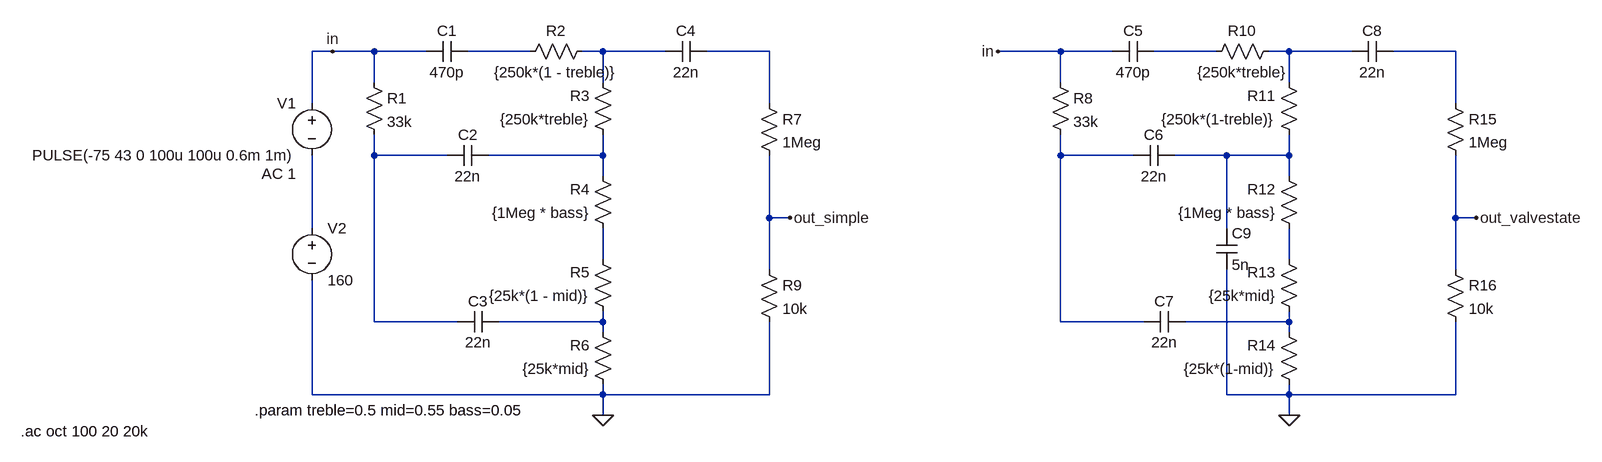
[diagram p0: schematic fmv.asc]
fmv.asc, the LTspice schematic file:
Version 4
SHEET 1 1936 776
WIRE -16 0 -48 0
WIRE 48 0 -16 0
WIRE 128 0 48 0
WIRE 288 0 192 0
WIRE 400 0 368 0
WIRE 496 0 400 0
WIRE 656 0 560 0
WIRE 1104 0 1008 0
WIRE 1184 0 1104 0
WIRE 1344 0 1248 0
WIRE 1456 0 1424 0
WIRE 1552 0 1456 0
WIRE 1712 0 1616 0
WIRE 48 48 48 0
WIRE 400 48 400 0
WIRE 1104 48 1104 0
WIRE 1456 48 1456 0
WIRE -48 80 -48 0
WIRE 656 80 656 0
WIRE 1712 80 1712 0
WIRE 48 160 48 128
WIRE 160 160 48 160
WIRE 400 160 400 128
WIRE 400 160 224 160
WIRE 1104 160 1104 128
WIRE 1216 160 1104 160
WIRE 1360 160 1280 160
WIRE 1456 160 1456 128
WIRE 1456 160 1360 160
WIRE 400 192 400 160
WIRE 1456 192 1456 160
WIRE 656 256 656 160
WIRE 688 256 656 256
WIRE 1712 256 1712 160
WIRE 1744 256 1712 256
WIRE -48 272 -48 160
WIRE 1360 272 1360 160
WIRE 400 320 400 272
WIRE 1456 320 1456 272
WIRE 656 336 656 256
WIRE 1712 336 1712 256
WIRE 48 416 48 160
WIRE 176 416 48 416
WIRE 400 416 400 400
WIRE 400 416 240 416
WIRE 1104 416 1104 160
WIRE 1232 416 1104 416
WIRE 1456 416 1456 400
WIRE 1456 416 1296 416
WIRE 400 432 400 416
WIRE 1456 432 1456 416
WIRE -48 528 -48 352
WIRE 400 528 400 512
WIRE 400 528 -48 528
WIRE 656 528 656 416
WIRE 656 528 400 528
WIRE 1360 528 1360 336
WIRE 1456 528 1456 512
WIRE 1456 528 1360 528
WIRE 1712 528 1712 416
WIRE 1712 528 1456 528
WIRE 400 560 400 528
WIRE 1456 560 1456 528
FLAG 400 560 0
FLAG 688 256 out_simple
FLAG 1456 560 0
FLAG 1744 256 out_valvestate
FLAG -16 0 in
FLAG 1008 0 in
SYMBOL res 32 32 R0
SYMATTR InstName R1
SYMATTR Value 33k
SYMBOL res 384 -16 R90
WINDOW 0 0 56 VBottom 2
WINDOW 3 32 56 VTop 2
SYMATTR InstName R2
SYMATTR Value {250k*(1 - treble)}
SYMBOL res 416 144 R180
WINDOW 0 36 76 Left 2
WINDOW 3 36 40 Left 2
SYMATTR InstName R3
SYMATTR Value {250k*treble}
SYMBOL res 416 288 R180
WINDOW 0 36 76 Left 2
WINDOW 3 36 40 Left 2
SYMATTR InstName R4
SYMATTR Value {1Meg * bass}
SYMBOL res 416 416 R180
WINDOW 0 36 76 Left 2
WINDOW 3 36 40 Left 2
SYMATTR InstName R5
SYMATTR Value {25k*(1 - mid)}
SYMBOL res 416 528 R180
WINDOW 0 36 76 Left 2
WINDOW 3 36 40 Left 2
SYMATTR InstName R6
SYMATTR Value {25k*mid}
SYMBOL cap 192 -16 R90
WINDOW 0 0 32 VBottom 2
WINDOW 3 32 32 VTop 2
SYMATTR InstName C1
SYMATTR Value 470p
SYMBOL cap 224 144 R90
WINDOW 0 0 32 VBottom 2
WINDOW 3 32 32 VTop 2
SYMATTR InstName C2
SYMATTR Value 22n
SYMBOL cap 240 400 R90
WINDOW 0 0 32 VBottom 2
WINDOW 3 32 32 VTop 2
SYMATTR InstName C3
SYMATTR Value 22n
SYMBOL res 640 64 R0
SYMATTR InstName R7
SYMATTR Value 1Meg
SYMBOL res 640 320 R0
SYMATTR InstName R9
SYMATTR Value 10k
SYMBOL voltage -48 64 M0
WINDOW 123 24 124 Left 2
WINDOW 39 0 0 Left 2
SYMATTR Value2 AC 1
SYMATTR InstName V1
SYMATTR Value PULSE(-75 43 0 100u 100u 0.6m 1m)
SYMBOL cap 560 -16 R90
WINDOW 0 0 32 VBottom 2
WINDOW 3 32 32 VTop 2
SYMATTR InstName C4
SYMATTR Value 22n
SYMBOL voltage -48 256 R0
WINDOW 123 0 0 Left 2
WINDOW 39 0 0 Left 2
SYMATTR InstName V2
SYMATTR Value 160
SYMBOL res 1088 32 R0
SYMATTR InstName R8
SYMATTR Value 33k
SYMBOL res 1440 -16 R90
WINDOW 0 0 56 VBottom 2
WINDOW 3 32 56 VTop 2
SYMATTR InstName R10
SYMATTR Value {250k*treble}
SYMBOL res 1472 144 R180
WINDOW 0 36 76 Left 2
WINDOW 3 36 40 Left 2
SYMATTR InstName R11
SYMATTR Value {250k*(1-treble)}
SYMBOL res 1472 288 R180
WINDOW 0 36 76 Left 2
WINDOW 3 36 40 Left 2
SYMATTR InstName R12
SYMATTR Value {1Meg * bass}
SYMBOL res 1472 416 R180
WINDOW 0 36 76 Left 2
WINDOW 3 36 40 Left 2
SYMATTR InstName R13
SYMATTR Value {25k*mid}
SYMBOL res 1472 528 R180
WINDOW 0 36 76 Left 2
WINDOW 3 36 40 Left 2
SYMATTR InstName R14
SYMATTR Value {25k*(1-mid)}
SYMBOL cap 1248 -16 R90
WINDOW 0 0 32 VBottom 2
WINDOW 3 32 32 VTop 2
SYMATTR InstName C5
SYMATTR Value 470p
SYMBOL cap 1280 144 R90
WINDOW 0 0 32 VBottom 2
WINDOW 3 32 32 VTop 2
SYMATTR InstName C6
SYMATTR Value 22n
SYMBOL cap 1296 400 R90
WINDOW 0 0 32 VBottom 2
WINDOW 3 32 32 VTop 2
SYMATTR InstName C7
SYMATTR Value 22n
SYMBOL res 1696 64 R0
SYMATTR InstName R15
SYMATTR Value 1Meg
SYMBOL res 1696 320 R0
SYMATTR InstName R16
SYMATTR Value 10k
SYMBOL cap 1616 -16 R90
WINDOW 0 0 32 VBottom 2
WINDOW 3 32 32 VTop 2
SYMATTR InstName C8
SYMATTR Value 22n
SYMBOL cap 1344 272 R0
SYMATTR InstName C9
SYMATTR Value 5n
TEXT -136 552 Left 2 !.param treble=0.5 mid=0.55 bass=0.05
TEXT -496 584 Left 2 !.ac oct 100 20 20k

The netlist it stands for:
* fmv.asc
R1 in N007 33k
R2 N002 N001 {250k*(1 - treble)}
R3 N008 N002 {250k*treble}
R4 N012 N008 {1Meg * bass}
R5 N014 N012 {25k*(1 - mid)}
R6 0 N014 {25k*mid}
C1 N001 in 470p
C2 N008 N007 22n
C3 N014 N007 22n
R7 N003 out_simple 1Meg
R9 out_simple 0 10k
V1 in N011 PULSE(-75 43 0 100u 100u 0.6m 1m) AC 1
C4 N003 N002 22n
V2 N011 0 160
R8 in N009 33k
R10 N005 N004 {250k*treble}
R11 N010 N005 {250k*(1-treble)}
R12 N013 N010 {1Meg * bass}
R13 N015 N013 {25k*mid}
R14 0 N015 {25k*(1-mid)}
C5 N004 in 470p
C6 N010 N009 22n
C7 N015 N009 22n
R15 N006 out_valvestate 1Meg
R16 out_valvestate 0 10k
C8 N006 N005 22n
C9 N010 0 5n
.param treble=0.5 mid=0.55 bass=0.05
.ac oct 100 20 20k
.backanno
.end